# Altium schematic sheet drivers.SchDoc
size A4
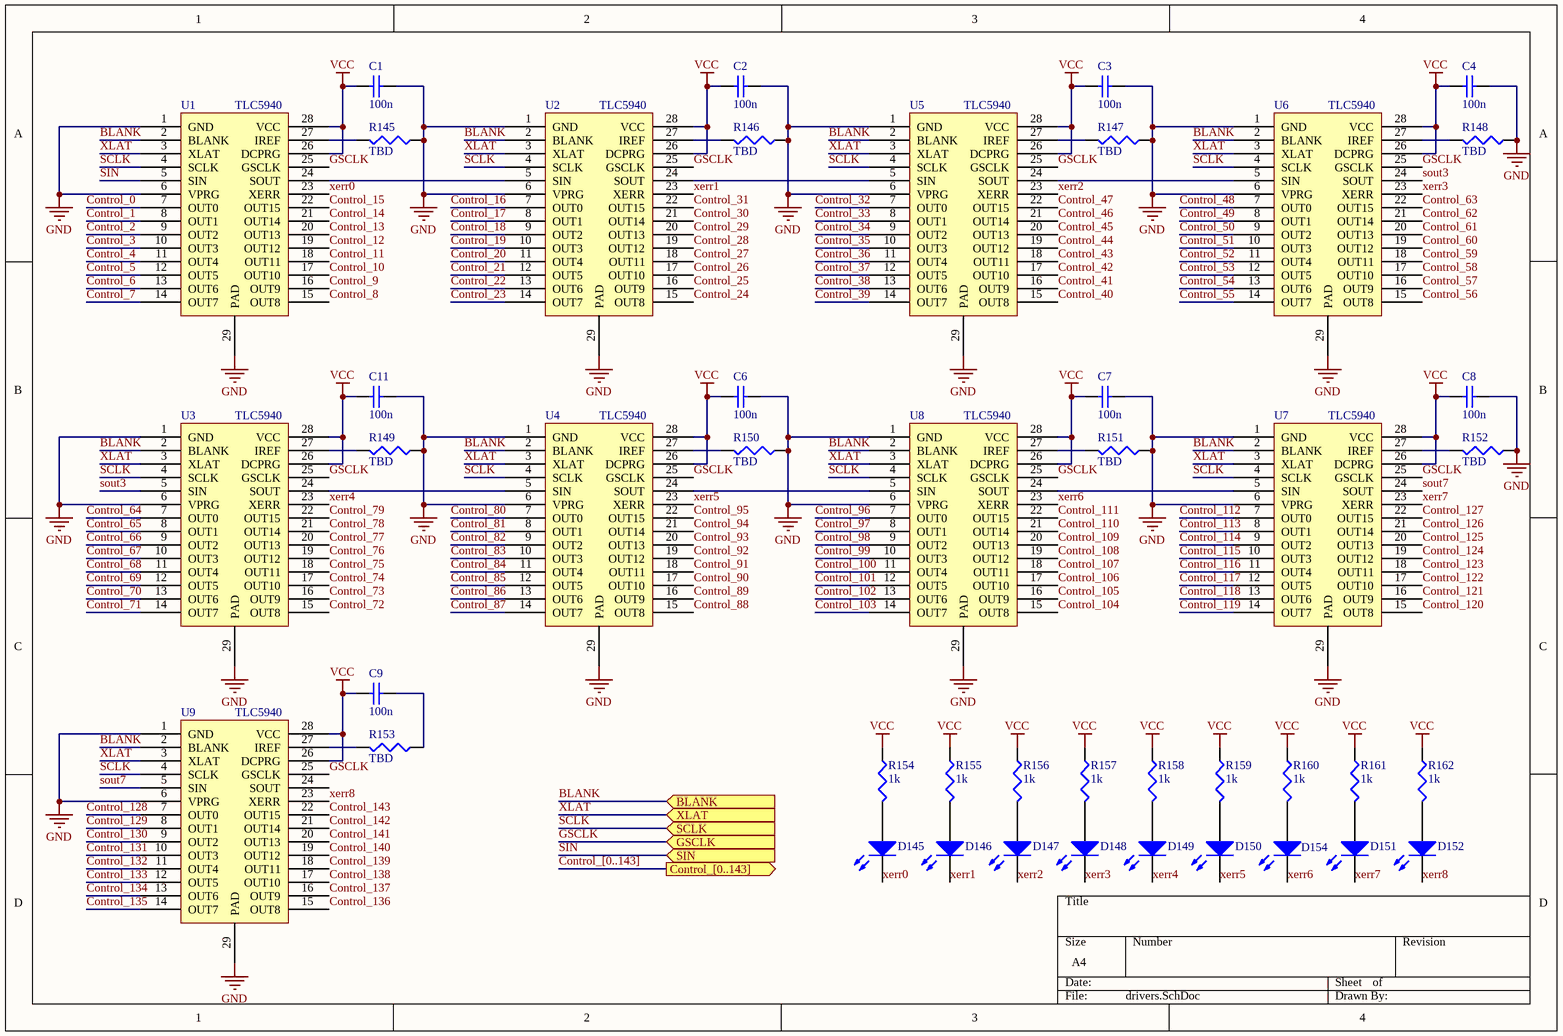
[diagram p0: drivers.SchDoc]

## Parts
C1  value 100n  [1608[0603]]  (hidden comment: Cap Semi)
C2  value 100n  [1608[0603]]  (hidden comment: Cap Semi)
C3  value 100n  [1608[0603]]  (hidden comment: Cap Semi)
C4  value 100n  [1608[0603]]  (hidden comment: Cap Semi)
C6  value 100n  [1608[0603]]  (hidden comment: Cap Semi)
C7  value 100n  [1608[0603]]  (hidden comment: Cap Semi)
C8  value 100n  [1608[0603]]  (hidden comment: Cap Semi)
C9  value 100n  [1608[0603]]  (hidden comment: Cap Semi)
C11  value 100n  [1608[0603]]  (hidden comment: Cap Semi)
D145  LED0  [J1-0603]  (value not drawn)
D146  LED0  [J1-0603]  (value not drawn)
D147  LED0  [J1-0603]  (value not drawn)
D148  LED0  [J1-0603]  (value not drawn)
D149  LED0  [J1-0603]  (value not drawn)
D150  LED0  [J1-0603]  (value not drawn)
D151  LED0  [J1-0603]  (value not drawn)
D152  LED0  [J1-0603]  (value not drawn)
D154  LED0  [J1-0603]  (value not drawn)
R145  value TBD  [J1-0603]  (hidden comment: Res3)
R146  value TBD  [J1-0603]  (hidden comment: Res3)
R147  value TBD  [J1-0603]  (hidden comment: Res3)
R148  value TBD  [J1-0603]  (hidden comment: Res3)
R149  value TBD  [J1-0603]  (hidden comment: Res3)
R150  value TBD  [J1-0603]  (hidden comment: Res3)
R151  value TBD  [J1-0603]  (hidden comment: Res3)
R152  value TBD  [J1-0603]  (hidden comment: Res3)
R153  value TBD  [J1-0603]  (hidden comment: Res3)
R154  value 1k  [J1-0603]  (hidden comment: Res3)
R155  value 1k  [J1-0603]  (hidden comment: Res3)
R156  value 1k  [J1-0603]  (hidden comment: Res3)
R157  value 1k  [J1-0603]  (hidden comment: Res3)
R158  value 1k  [J1-0603]  (hidden comment: Res3)
R159  value 1k  [J1-0603]  (hidden comment: Res3)
R160  value 1k  [J1-0603]  (hidden comment: Res3)
R161  value 1k  [J1-0603]  (hidden comment: Res3)
R162  value 1k  [J1-0603]  (hidden comment: Res3)
U1  TLC5940  [HTSSOP28]
U2  TLC5940  [HTSSOP28]
U3  TLC5940  [HTSSOP28]
U4  TLC5940  [HTSSOP28]
U5  TLC5940  [HTSSOP28]
U6  TLC5940  [HTSSOP28]
U7  TLC5940  [HTSSOP28]
U8  TLC5940  [HTSSOP28]
U9  TLC5940  [HTSSOP28]

## Ports
BLANK (in), Control_[0..143] (out), GSCLK (in), SCLK (in), SIN (in), XLAT (in)

## Nets
GND: C1.1 C2.1 C3.1 C4.1 C6.1 C7.1 C8.1 C11.1 R145.1 R146.1 R147.1 R148.1 R149.1 R150.1 R151.1 R152.1 U1.1(GND) U1.6(VPRG) U1.29(PAD) U2.1(GND) U2.6(VPRG) U2.29(PAD) U3.1(GND) U3.6(VPRG) U3.29(PAD) U4.1(GND) U4.6(VPRG) U4.29(PAD) U5.1(GND) U5.6(VPRG) U5.29(PAD) U6.1(GND) U6.6(VPRG) U6.29(PAD) U7.1(GND) U7.6(VPRG) U7.29(PAD) U8.1(GND) U8.6(VPRG) U8.29(PAD) U9.1(GND) U9.6(VPRG) U9.29(PAD)
VCC: C1.2 C2.2 C3.2 C4.2 C6.2 C7.2 C8.2 C9.2 C11.2 R154.1 R155.1 R156.1 R157.1 R158.1 R159.1 R160.1 R161.1 R162.1 U1.26(DCPRG) U1.28(VCC) U2.26(DCPRG) U2.28(VCC) U3.26(DCPRG) U3.28(VCC) U4.26(DCPRG) U4.28(VCC) U5.26(DCPRG) U5.28(VCC) U6.26(DCPRG) U6.28(VCC) U7.26(DCPRG) U7.28(VCC) U8.26(DCPRG) U8.28(VCC) U9.26(DCPRG) U9.28(VCC)
BLANK: U1.2(BLANK) U2.2(BLANK) U3.2(BLANK) U4.2(BLANK) U5.2(BLANK) U6.2(BLANK) U7.2(BLANK) U8.2(BLANK) U9.2(BLANK) ; port BLANK
Control_0: U1.7(OUT0)
Control_1: U1.8(OUT1)
Control_2: U1.9(OUT2)
Control_3: U1.10(OUT3)
Control_4: U1.11(OUT4)
Control_5: U1.12(OUT5)
Control_6: U1.13(OUT6)
Control_7: U1.14(OUT7)
Control_8: U1.15(OUT8)
Control_9: U1.16(OUT9)
Control_10: U1.17(OUT10)
Control_11: U1.18(OUT11)
Control_12: U1.19(OUT12)
Control_13: U1.20(OUT13)
Control_14: U1.21(OUT14)
Control_15: U1.22(OUT15)
Control_16: U2.7(OUT0)
Control_17: U2.8(OUT1)
Control_18: U2.9(OUT2)
Control_19: U2.10(OUT3)
Control_20: U2.11(OUT4)
Control_21: U2.12(OUT5)
Control_22: U2.13(OUT6)
Control_23: U2.14(OUT7)
Control_24: U2.15(OUT8)
Control_25: U2.16(OUT9)
Control_26: U2.17(OUT10)
Control_27: U2.18(OUT11)
Control_28: U2.19(OUT12)
Control_29: U2.20(OUT13)
Control_30: U2.21(OUT14)
Control_31: U2.22(OUT15)
Control_32: U5.7(OUT0)
Control_33: U5.8(OUT1)
Control_34: U5.9(OUT2)
Control_35: U5.10(OUT3)
Control_36: U5.11(OUT4)
Control_37: U5.12(OUT5)
Control_38: U5.13(OUT6)
Control_39: U5.14(OUT7)
Control_40: U5.15(OUT8)
Control_41: U5.16(OUT9)
Control_42: U5.17(OUT10)
Control_43: U5.18(OUT11)
Control_44: U5.19(OUT12)
Control_45: U5.20(OUT13)
Control_46: U5.21(OUT14)
Control_47: U5.22(OUT15)
Control_48: U6.7(OUT0)
Control_49: U6.8(OUT1)
Control_50: U6.9(OUT2)
Control_51: U6.10(OUT3)
Control_52: U6.11(OUT4)
Control_53: U6.12(OUT5)
Control_54: U6.13(OUT6)
Control_55: U6.14(OUT7)
Control_56: U6.15(OUT8)
Control_57: U6.16(OUT9)
Control_58: U6.17(OUT10)
Control_59: U6.18(OUT11)
Control_60: U6.19(OUT12)
Control_61: U6.20(OUT13)
Control_62: U6.21(OUT14)
Control_63: U6.22(OUT15)
Control_64: U3.7(OUT0)
Control_65: U3.8(OUT1)
Control_66: U3.9(OUT2)
Control_67: U3.10(OUT3)
Control_68: U3.11(OUT4)
Control_69: U3.12(OUT5)
Control_70: U3.13(OUT6)
Control_71: U3.14(OUT7)
Control_72: U3.15(OUT8)
Control_73: U3.16(OUT9)
Control_74: U3.17(OUT10)
Control_75: U3.18(OUT11)
Control_76: U3.19(OUT12)
Control_77: U3.20(OUT13)
Control_78: U3.21(OUT14)
Control_79: U3.22(OUT15)
Control_80: U4.7(OUT0)
Control_81: U4.8(OUT1)
Control_82: U4.9(OUT2)
Control_83: U4.10(OUT3)
Control_84: U4.11(OUT4)
Control_85: U4.12(OUT5)
Control_86: U4.13(OUT6)
Control_87: U4.14(OUT7)
Control_88: U4.15(OUT8)
Control_89: U4.16(OUT9)
Control_90: U4.17(OUT10)
Control_91: U4.18(OUT11)
Control_92: U4.19(OUT12)
Control_93: U4.20(OUT13)
Control_94: U4.21(OUT14)
Control_95: U4.22(OUT15)
Control_96: U8.7(OUT0)
Control_97: U8.8(OUT1)
Control_98: U8.9(OUT2)
Control_99: U8.10(OUT3)
Control_100: U8.11(OUT4)
Control_101: U8.12(OUT5)
Control_102: U8.13(OUT6)
Control_103: U8.14(OUT7)
Control_104: U8.15(OUT8)
Control_105: U8.16(OUT9)
Control_106: U8.17(OUT10)
Control_107: U8.18(OUT11)
Control_108: U8.19(OUT12)
Control_109: U8.20(OUT13)
Control_110: U8.21(OUT14)
Control_111: U8.22(OUT15)
Control_112: U7.7(OUT0)
Control_113: U7.8(OUT1)
Control_114: U7.9(OUT2)
Control_115: U7.10(OUT3)
Control_116: U7.11(OUT4)
Control_117: U7.12(OUT5)
Control_118: U7.13(OUT6)
Control_119: U7.14(OUT7)
Control_120: U7.15(OUT8)
Control_121: U7.16(OUT9)
Control_122: U7.17(OUT10)
Control_123: U7.18(OUT11)
Control_124: U7.19(OUT12)
Control_125: U7.20(OUT13)
Control_126: U7.21(OUT14)
Control_127: U7.22(OUT15)
Control_128: U9.7(OUT0)
Control_129: U9.8(OUT1)
Control_130: U9.9(OUT2)
Control_131: U9.10(OUT3)
Control_132: U9.11(OUT4)
Control_133: U9.12(OUT5)
Control_134: U9.13(OUT6)
Control_135: U9.14(OUT7)
Control_136: U9.15(OUT8)
Control_137: U9.16(OUT9)
Control_138: U9.17(OUT10)
Control_139: U9.18(OUT11)
Control_140: U9.19(OUT12)
Control_141: U9.20(OUT13)
Control_142: U9.21(OUT14)
Control_143: U9.22(OUT15)
GSCLK: U1.25(GSCLK) U2.25(GSCLK) U3.25(GSCLK) U4.25(GSCLK) U5.25(GSCLK) U6.25(GSCLK) U7.25(GSCLK) U8.25(GSCLK) U9.25(GSCLK) ; port GSCLK
SCLK: U1.4(SCLK) U2.4(SCLK) U3.4(SCLK) U4.4(SCLK) U5.4(SCLK) U6.4(SCLK) U7.4(SCLK) U8.4(SCLK) U9.4(SCLK) ; port SCLK
SIN: U1.5(SIN) ; port SIN
sout3: U3.5(SIN) U6.24(SOUT)
sout7: U7.24(SOUT) U9.5(SIN)
xerr0: D145.2(K) U1.23(XERR)
xerr1: D146.2(K) U2.23(XERR)
xerr2: D147.2(K) U5.23(XERR)
xerr3: D148.2(K) U6.23(XERR)
xerr4: D149.2(K) U3.23(XERR)
xerr5: D150.2(K) U4.23(XERR)
xerr6: D154.2(K) U8.23(XERR)
xerr7: D151.2(K) U7.23(XERR)
xerr8: D152.2(K) U9.23(XERR)
XLAT: U1.3(XLAT) U2.3(XLAT) U3.3(XLAT) U4.3(XLAT) U5.3(XLAT) U6.3(XLAT) U7.3(XLAT) U8.3(XLAT) U9.3(XLAT) ; port XLAT
NetC9_1: C9.1 R153.1
NetD145_1: D145.1(A) R154.2
NetD146_1: D146.1(A) R155.2
NetD147_1: D147.1(A) R156.2
NetD148_1: D148.1(A) R157.2
NetD149_1: D149.1(A) R158.2
NetD150_1: D150.1(A) R159.2
NetD151_1: D151.1(A) R161.2
NetD152_1: D152.1(A) R162.2
NetD154_1: D154.1(A) R160.2
NetR145_2: R145.2 U1.27(IREF)
NetR146_2: R146.2 U2.27(IREF)
NetR147_2: R147.2 U5.27(IREF)
NetR148_2: R148.2 U6.27(IREF)
NetR149_2: R149.2 U3.27(IREF)
NetR150_2: R150.2 U4.27(IREF)
NetR151_2: R151.2 U8.27(IREF)
NetR152_2: R152.2 U7.27(IREF)
NetR153_2: R153.2 U9.27(IREF)
NetU1_24: U1.24(SOUT) U2.5(SIN)
NetU2_24: U2.24(SOUT) U5.5(SIN)
NetU3_24: U3.24(SOUT) U4.5(SIN)
NetU4_24: U4.24(SOUT) U8.5(SIN)
NetU5_24: U5.24(SOUT) U6.5(SIN)
NetU7_5: U7.5(SIN) U8.24(SOUT)

Not connected (* = marked no-connect by the designer): U9 24(SOUT)

## Buses and harness runs
bus Control_[0..143] = port Control_[0..143]

## Library data of the parts
C1-C4 C6-C9 C11 = Cap Semi: Capacitor (Semiconductor SIM Model); Published: 8-Jun-2000; LatestRevisionDate: 29-May-2009; LatestRevisionNote: IPC-7351 Footprint Added.; PackageReference: C1206; Publisher: Altium Limited; PackageDescription: Chip Capacitor
D145-D152 D154 = LED0: Typical INFRARED GaAs LED; Published: 8-Jun-2000; LatestRevisionDate: 08-Jul-2005; LatestRevisionNote: Mech Layer 1 removed.; PackageReference: LED-0; Publisher: Altium Limited; PackageDescription: LED; 2 Leads
R145-R162 = Res3: Resistor; Published: 8-Jun-2000; LatestRevisionDate: 29-May-2009; LatestRevisionNote: IPC-7351 Footprint Added.; PackageReference: J1-0603; Publisher: Altium Limited; PackageDescription: Chip Resistor
U1-U9 = TLC5940: 16 CHANNEL LED DRIVER WITH DOT CORRECTION AND GRAYSCALE PWM CONTROL; Part number: 1755256